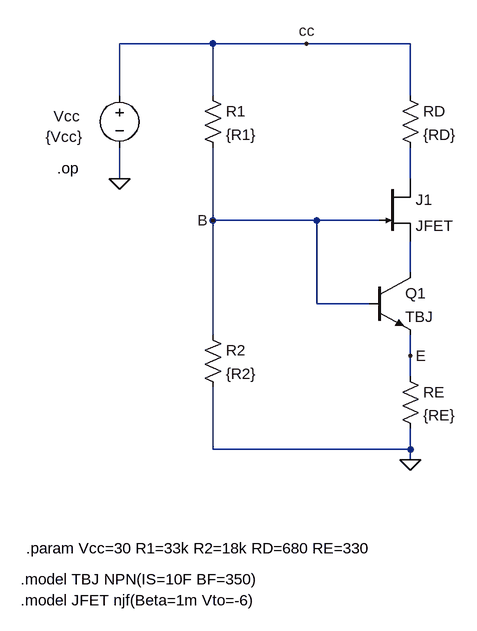
[diagram p0: schematic COMB02op.asc]
COMB02op.asc, the LTspice schematic file:
Version 4
SHEET 1 1608 1076
WIRE 880 -144 736 -144
WIRE 1024 -144 880 -144
WIRE 1184 -144 1024 -144
WIRE 736 -64 736 -144
WIRE 880 -64 880 -144
WIRE 1184 -64 1184 -144
WIRE 736 64 736 16
WIRE 1184 64 1184 16
WIRE 880 128 880 16
WIRE 1040 128 880 128
WIRE 1136 128 1040 128
WIRE 1184 208 1184 160
WIRE 1040 256 1040 128
WIRE 1120 256 1040 256
WIRE 880 304 880 128
WIRE 1184 336 1184 304
WIRE 1184 368 1184 336
WIRE 880 480 880 384
WIRE 1184 480 1184 448
WIRE 1184 480 880 480
WIRE 1184 496 1184 480
FLAG 1184 496 0
FLAG 736 64 0
FLAG 1024 -144 cc
FLAG 880 128 B
FLAG 1184 336 E
SYMBOL njf 1136 64 R0
SYMATTR InstName J1
SYMATTR Value JFET
SYMBOL res 1168 -80 R0
SYMATTR InstName RD
SYMATTR Value {RD}
SYMBOL voltage 736 -80 R0
WINDOW 123 0 0 Left 0
WINDOW 39 0 0 Left 0
WINDOW 0 -101 48 Left 2
WINDOW 3 -114 79 Left 2
SYMATTR InstName Vcc
SYMATTR Value {Vcc}
SYMBOL npn 1120 208 R0
SYMATTR InstName Q1
SYMATTR Value TBJ
SYMBOL res 1168 352 R0
SYMATTR InstName RE
SYMATTR Value {RE}
SYMBOL res 864 -80 R0
SYMATTR InstName R1
SYMATTR Value {R1}
SYMBOL res 864 288 R0
SYMATTR InstName R2
SYMATTR Value {R2}
TEXT 640 48 Left 2 !.op
TEXT 584 712 Left 2 !.model JFET njf(Beta=1m Vto=-6)
TEXT 592 632 Left 2 !.param Vcc=30 R1=33k R2=18k RD=680 RE=330
TEXT 584 680 Left 2 !.model TBJ NPN(IS=10F BF=350)

The netlist it stands for:
* COMB02op.asc
J1 N001 B N002 JFET
RD cc N001 {RD}
Vcc cc 0 {Vcc}
Q1 N002 B E 0 TBJ
RE E 0 {RE}
R1 cc B {R1}
R2 B 0 {R2}
.model NPN NPN
.model PNP PNP
.lib standard.bjt
.model NJF NJF
.model PJF PJF
.lib standard.jft
.op
.model JFET njf(Beta=1m Vto=-6)
.param Vcc=30 R1=33k R2=18k RD=680 RE=330
.model TBJ NPN(IS=10F BF=350)
.backanno
.end